# EAGLE design schematic_2 (EAGLE 8.7.0)
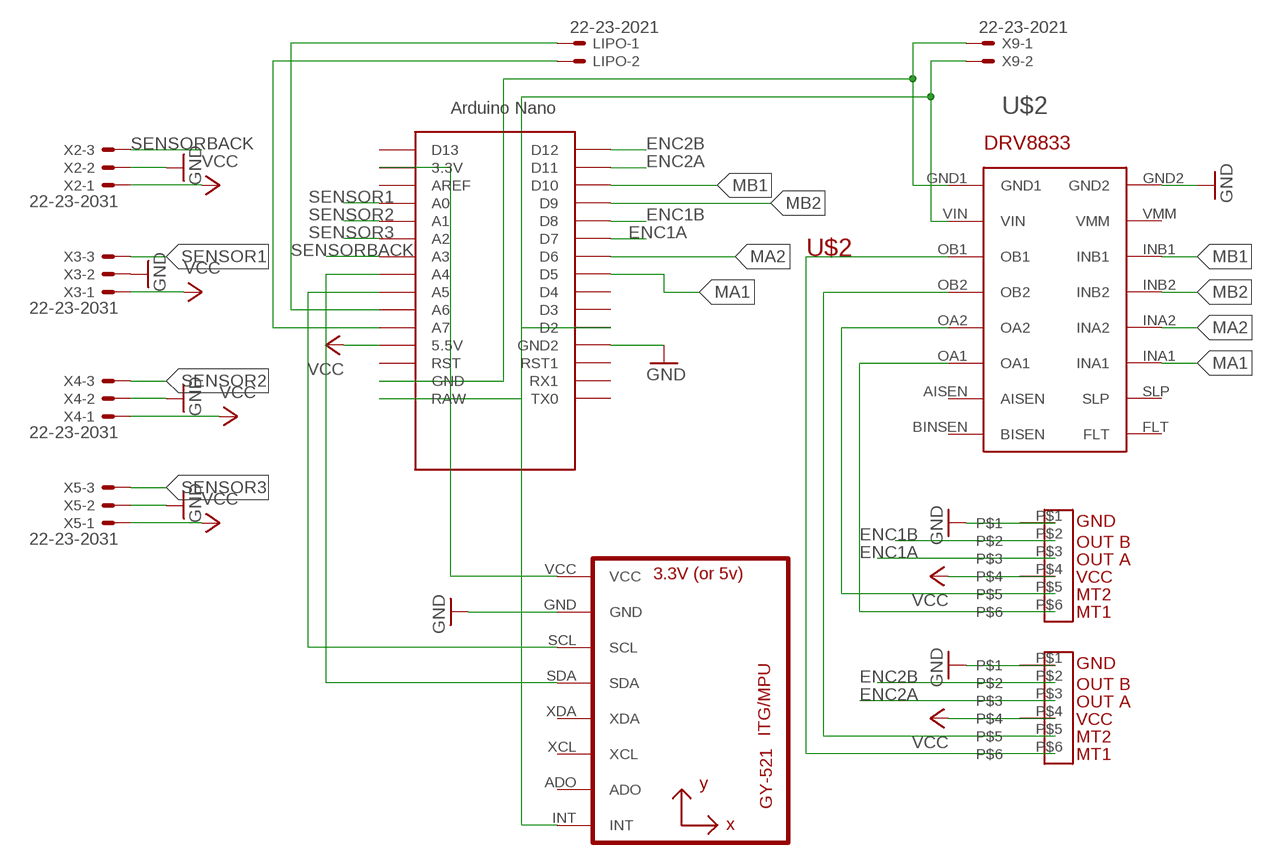
[diagram p0: schematic, sheet 1]

## Parts
LIPO  22-23-2021  [22-23-2021]
U1  GY-521MPU6050  [GY-521]
U$1  NANO  [NANO]
U$2  POLOLU-DRV8833  [POLOLU-DRV8833]
U$3  PINHEADER  [PINHEADER]
U$4  PINHEADER  [PINHEADER]
X2  22-23-2031  [22-23-2031]
X3  22-23-2031  [22-23-2031]
X4  22-23-2031  [22-23-2031]
X5  22-23-2031  [22-23-2031]
X9  22-23-2021  [22-23-2021]

## Nets
ENC1A: U$1.D7 U$3.P$3
ENC1B: U$1.D8 U$3.P$2
ENC2A: U$1.D11 U$4.P$3
ENC2B: U$1.D12 U$4.P$2
GND: U1.GND U$1.GND1(GND2) U$2.GND2 U$3.P$1 U$4.P$1 X2.2 X3.2 X4.2 X5.2
MA1: U$1.D5 U$2.INA1
MA2: U$1.D6 U$2.INA2
MB1: U$1.D10 U$2.INB1
MB2: U$1.D9 U$2.INB2
N$3: LIPO.1 U$1.A6
N$4: LIPO.2 U$1.A7
N$5: U1.VCC U$1.3.3V
N$6: U1.SCL U$1.A5
N$7: U1.SDA U$1.A4
N$8: U$2.OA2 U$3.P$5
N$9: U$1.GND U$2.GND1 X9.1
N$10: U$1.RAW U$2.VIN X9.2
N$11: U$2.OA1 U$3.P$6
N$12: U$2.OB2 U$4.P$5
N$13: U$2.OB1 U$4.P$6
N$14: U1.INT U$1.D2
SENSOR1: U$1.A0 X3.3
SENSOR2: U$1.A1 X4.3
SENSOR3: U$1.A2 X5.3
SENSORBACK: U$1.A3 X2.3
VCC: U$1.5V(5.5V) U$3.P$4 U$4.P$4 X2.1 X3.1 X4.1 X5.1
Unconnected: U1.ADO U1.XCL U1.XDA U$1.AREF U$1.D3 U$1.D4 U$1.D13 U$1.ICSP1 U$1.ICSP2 U$1.ICSP3 U$1.ICSP4 U$1.ICSP5 U$1.ICSP6 U$1.RST U$1.RST1 U$1.RX1 U$1.TX0 U$2.AISEN U$2.BINSEN(BISEN) U$2.FLT U$2.SLP U$2.VMM

## Library data of the parts
LIPO X9 = con-molex:22-23-2021: .100" (2.54mm) Center Header - 2 Pin; MF: MOLEX; MPN: 22-23-2021; OC_FARNELL: 1462926; OC_NEWARK: 25C3832
U1 = gy-521:GY-521
U$1 = Arduino-clone:NANO: Arduino Nano
U$2 = Pololu_Driver_DRV8833:POLOLU-DRV8833: Created by: Deltarios DRV8833 pololu dual drive controller, PCB-ready device
U$3 U$4 = pololu encoder board:PINHEADER
X2-X5 = con-molex:22-23-2031: .100" (2.54mm) Center Header - 3 Pin; MF: MOLEX; MPN: 22-23-2031; OC_FARNELL: 1462950; OC_NEWARK: 30C0862

## Net classes
0 default: width 0.254 mm, drill 0.254 mm, clearance 0.508 mm

## Board
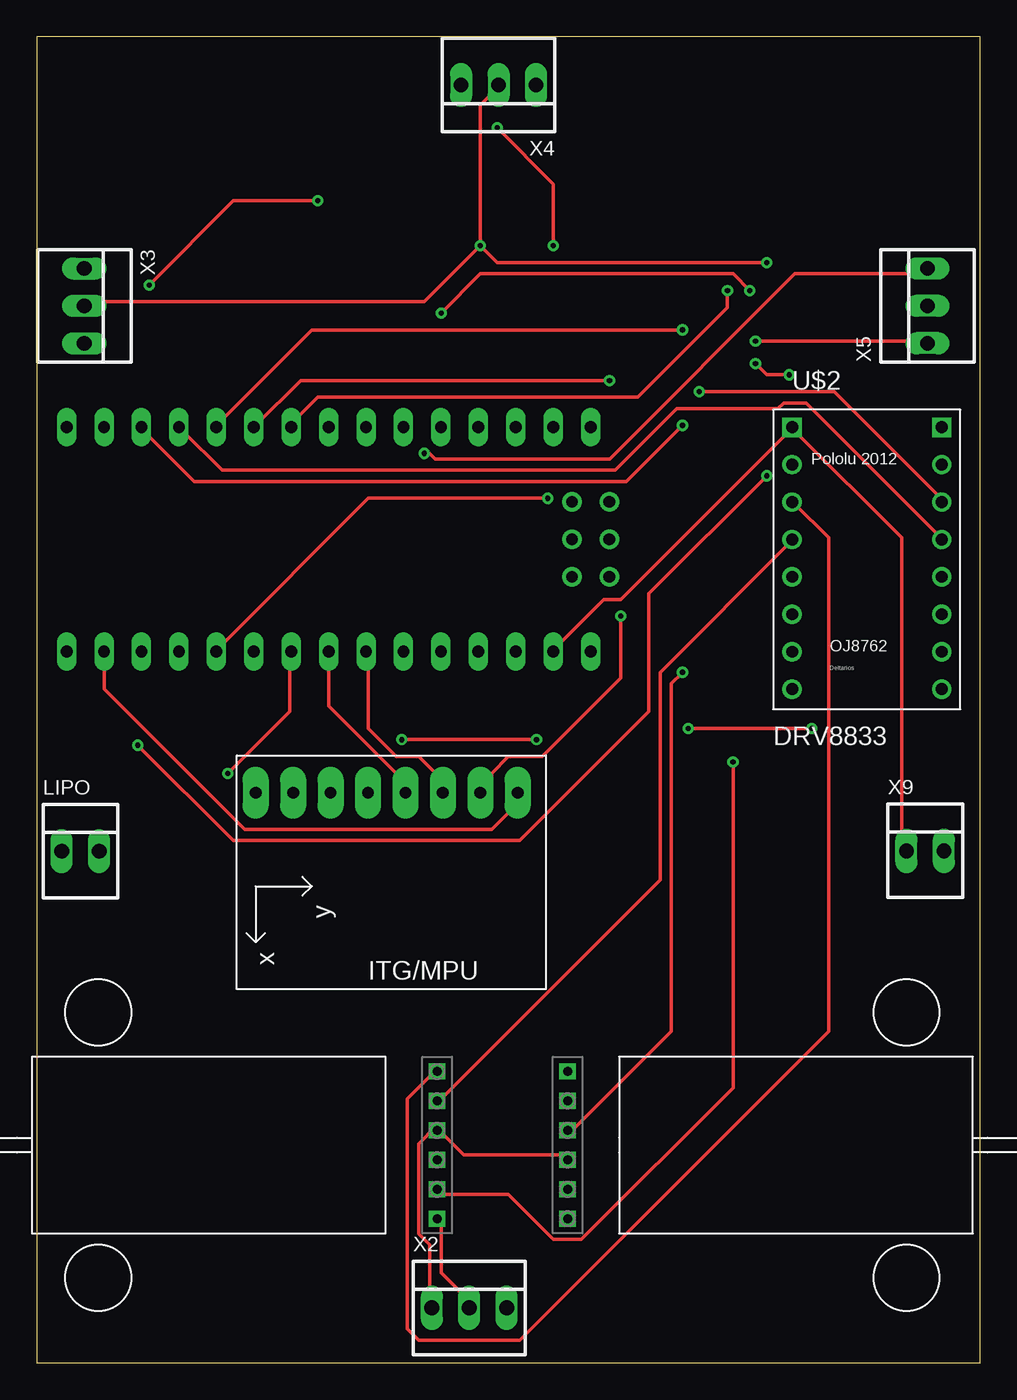
[diagram p1: board, top side]
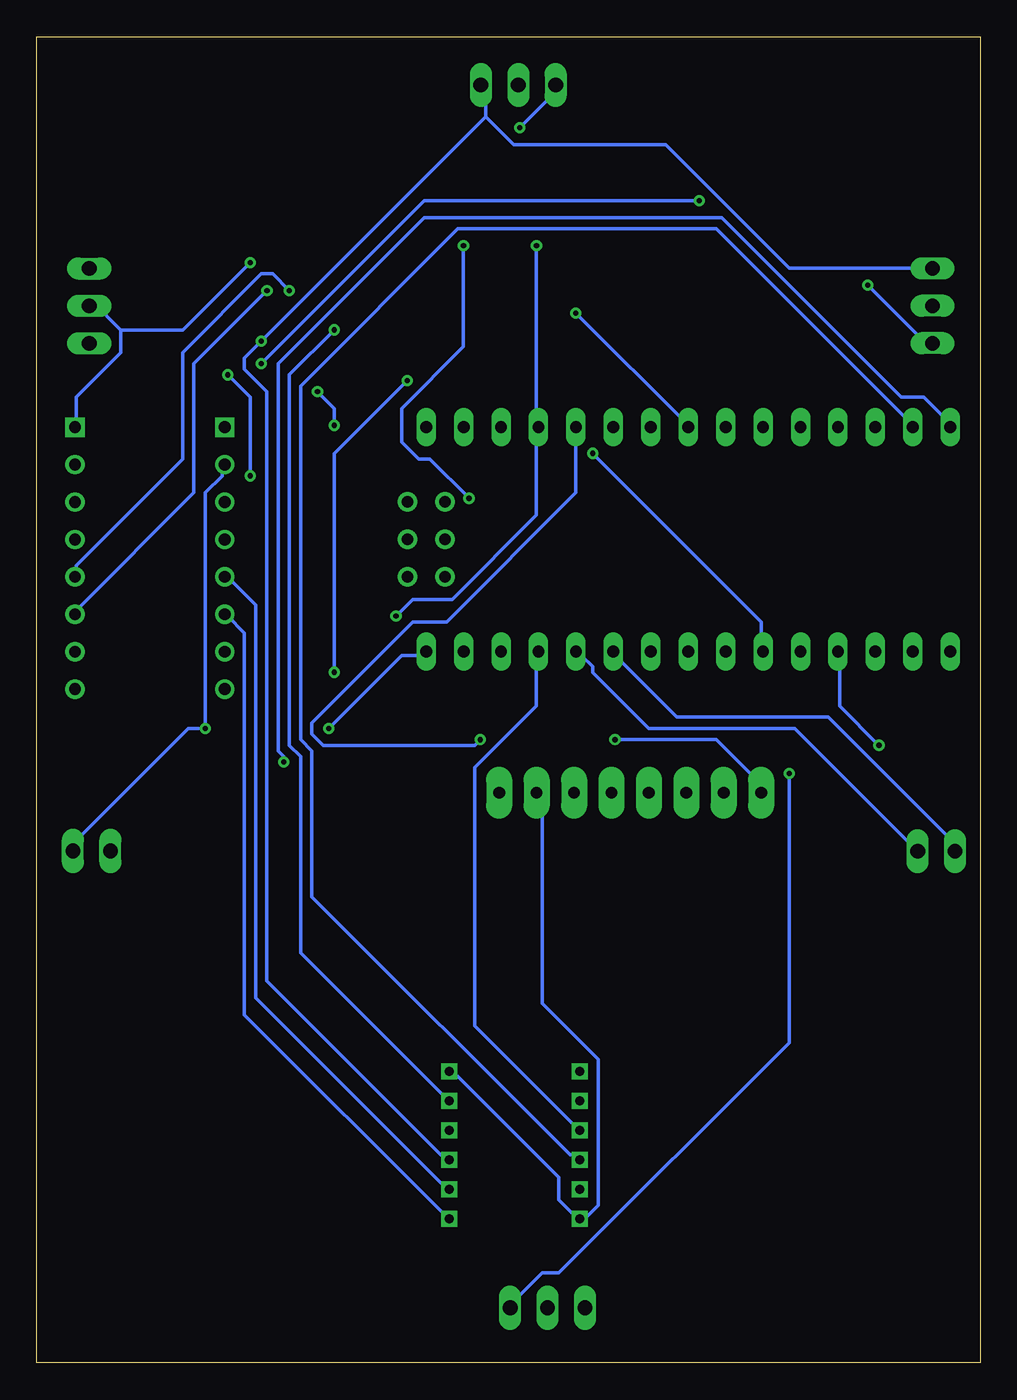
[diagram p2: board, bottom side, seen from below]

Size 64 x 90 mm. Coordinates in mm from the lower left corner, seen from the top.
Outline: 0,0 64,0 64,90 0,90 0,0
Copper layers (1*16): Top 0.035mm / dielectric 1.5mm / Bottom 0.035mm
Design rules "default": minimum track width 6mil, minimum drill 0.35mm, track to track 6mil, track to pad 6mil, pad to pad 6mil, via to via 6mil, smd to smd 6mil, copper to edge 40mil, drill to drill 6mil, minimum pad ring 10mil, minimum via ring 8mil, stop-mask expansion 4mil, vias tented up to drill 0mil, thermal gap 10mil

### Footprints (pad centres in the part's own frame; a part is rotated, then mirrored left to right if it is on the bottom)
22-23-2021 = drill 1 long: 1 -1.27,0; 2 1.27,0
GY-521 = drill 0.8 pad 1.778 long: ADO -8.89,-6.35; GND -8.89,6.35; INT -8.89,-8.89; SCL -8.89,3.81; SDA -8.89,1.27; VCC -8.89,8.89; XCL -8.89,-3.81; XDA -8.89,-1.27
NANO = drill 0.8 long: 3.3V -10.16,24.13; 5V -10.16,-1.27; A0 -10.16,19.05; A1 -10.16,16.51; A2 -10.16,13.97; A3 -10.16,11.43; A4 -10.16,8.89; A5 -10.16,6.35; A6 -10.16,3.81; A7 -10.16,1.27; AREF -10.16,21.59; D2 5.08,1.27; D3 5.08,3.81; D4 5.08,6.35; D5 5.08,8.89; D6 5.08,11.43; D7 5.08,13.97; D8 5.08,16.51; D9 5.08,19.05; D10 5.08,21.59; D11 5.08,24.13; D12 5.08,26.67; D13 -10.16,26.67; GND -10.16,-6.35; GND1 5.08,-1.27; RAW -10.16,-8.89; RST -10.16,-3.81; RST1 5.08,-3.81; RX1 5.08,-6.35; TX0 5.08,-8.89 | drill 0.8: ICSP1 -5.08,-10.16; ICSP2 -5.08,-7.62; ICSP3 -2.54,-10.16; ICSP4 -2.54,-7.62; ICSP5 0,-10.16; ICSP6 0,-7.62
POLOLU-DRV8833 = drill 0.8: AISEN -3.81,-7.62; BINSEN -3.81,-10.16; FLT 6.35,-10.16; INA1 6.35,-5.08; INA2 6.35,-2.54; INB1 6.35,2.54; INB2 6.35,0; OA1 -3.81,-5.08; OA2 -3.81,-2.54; OB1 -3.81,2.54; OB2 -3.81,0; SLP 6.35,-7.62; VIN -3.81,5.08; VMM 6.35,5.08 | drill 0.8 square: GND1 -3.81,7.62; GND2 6.35,7.62
PINHEADER = drill 0.6 square: P$1 0.5,0.5; P$2 2.5,0.5; P$3 4.5,0.5; P$4 6.5,0.5; P$5 8.5,0.5; P$6 10.5,0.5
22-23-2031 = drill 1 long: 1 -2.54,0; 2 0,0; 3 2.54,0

### Placement (x,y rotation side)
LIPO  2.96,34.72 0 top
U1  23.74,29.8 270 top
U$1  28.69,58.43 90 top
U$2  55.06,55.88 0 top
U$3  35.52,20.27 270 top
U$4  27.66,9.27 90 top
X2  29.34,3.72 0 top
X3  3.22,71.74 270 top
X4  31.33,86.74 180 top
X5  60.44,71.74 90 top
X9  60.28,34.74 0 top

### Tracks (layer width: path | path; a pad name or v marks a point on that pad's centre or on a via)
ENC1A  (via drill 0.35)
  Top 0.254: v43.81,46.86 43.05,46.1 43.05,22.48 36.58,16 36.2,16 U$3.P$3 | v38.86,66.67 17.91,66.67 14.86,63.63 U$1.D7
  Bottom 0.254: v43.81,46.86 43.81,61.72 v38.86,66.67
ENC1B  (via drill 0.35)
  Top 0.254: v43.81,70.1 18.67,70.1 12.19,63.63 U$1.D8
  Bottom 0.254: v43.81,70.1 46.86,67.06 46.86,41.91 46.1,41.15 46.1,27.81 36.2,17.91 U$3.P$2
ENC2A
  Bottom 0.254: U$4.P$3 27.43,14.1 27.81,14.1 45.34,31.62 45.34,41.53 46.1,42.29 46.1,66.29 35.43,76.96 17.91,76.96 4.57,63.63 U$1.D11
ENC2B  (via drill 0.35)
  Top 0.254: v47.24,40.77 47.24,18.67 36.96,8.38 35.05,8.38 32,11.43 27.43,11.43 U$4.P$2
  Bottom 0.254: v47.24,40.77 47.24,41.15 47.62,41.53 47.62,67.82 37.72,77.72 17.53,77.72 5.33,65.53 3.81,65.53 1.91,63.63 U$1.D12
GND  (via drill 0.35)
  Top 0.254: U$4.P$1 27.43,9.53 27.43,6.1 29.72,3.81 X2.2 | v30.1,75.82 30.1,85.34 31.24,86.49 X4.2 | v30.1,75.82 26.29,72.01 3.43,72.01 X3.2 | v49.53,74.68 31.24,74.68 v30.1,75.82 | v39.62,50.67 39.62,46.48 34.29,41.15 32,41.15 30.86,40.01 30.86,39.62 30.1,38.86 U1.GND
  Bottom 0.254: U$3.P$1 35.81,19.43 35.43,19.43 28.57,12.57 28.57,11.05 27.43,9.91 U$4.P$1 27.05,9.53 25.91,10.67 25.91,20.57 29.72,24.38 29.72,38.48 U1.GND | 58.29,70.1 58.29,68.58 61.34,65.53 61.34,63.63 U$2.GND2 | 58.29,70.1 60.2,72.01 X5.2 | v30.1,75.82 30.1,63.63 U$1.GND1 30.1,63.25 30.1,57.53 35.81,51.82 38.48,51.82 v39.62,50.67 | 58.29,70.1 54.1,70.1 v49.53,74.68
MA1  (via drill 0.35)
  Top 0.254: v48.39,72.77 47.24,73.91 30.1,73.91 v27.43,71.25
  Bottom 0.254: v48.39,72.77 53.34,67.82 53.34,59.05 61.34,51.05 U$2.INA1 | v27.43,71.25 19.81,63.63 U$1.D5
MA2  (via drill 0.35)
  Top 0.254: v46.86,72.77 46.86,71.63 40.77,65.53 19.05,65.53 17.14,63.63 U$1.D6
  Bottom 0.254: v46.86,72.77 48.01,73.91 48.77,73.91 54.1,68.58 54.1,61.34 61.34,54.1 61.34,53.34 U$2.INA2
MB1  (via drill 0.35)
  Top 0.254: v43.81,63.63 40.01,59.82 10.67,59.82 7.24,63.25 U$1.D10 | v44.96,65.91 54.1,65.91 61.34,58.67 U$2.INB1
  Bottom 0.254: v43.81,63.63 43.81,64.77 v44.96,65.91
MB2
  Top 0.254: U$1.D9 9.91,63.25 12.57,60.58 39.24,60.58 43.43,64.77 50.29,64.77 50.67,65.15 52.2,65.15 61.34,56.01 U$2.INB2
N$3
  Bottom 0.254: U$1.A6 24.77,48.01 20.57,43.81 10.29,43.81 1.52,35.05 LIPO.1
N$4
  Bottom 0.254: U$1.A7 27.05,48.01 26.29,47.24 26.29,46.86 22.48,43.05 12.57,43.05 4.57,35.05 LIPO.2
N$5
  Top 0.254: U$1.3.3V 4.57,48.01 4.57,45.72 14.1,36.2 30.86,36.2 32.38,37.72 32.38,38.48 U1.VCC
N$6
  Top 0.254: U$1.A5 22.48,48.01 22.48,43.05 24.38,41.15 25.91,41.15 27.43,39.62 27.43,38.86 U1.SCL
N$7
  Top 0.254: U$1.A4 19.81,48.01 19.81,44.58 24.77,39.62 24.77,38.86 U1.SDA
N$8
  Bottom 0.254: U$3.P$5 36.2,11.81 49.15,24.77 49.15,51.44 51.05,53.34 U$2.OA2
N$9
  Top 0.254: U$1.GND 35.05,48.39 38.48,51.82 39.62,51.82 51.05,63.25 U$2.GND1 51.44,63.25 58.67,56.01 58.67,35.05 X9.1
N$10  (via drill 0.35)
  Top 0.254: v52.58,43.05 v44.2,43.05
  Bottom 0.254: v44.2,43.05 39.24,48.01 37.72,48.01 U$1.RAW | X9.2 61.72,35.05 53.72,43.05 v52.58,43.05 52.58,59.05 51.44,60.2 51.44,60.96 U$2.VIN
N$11
  Bottom 0.254: U$3.P$6 36.2,9.91 49.91,23.62 49.91,49.53 51.05,50.67 U$2.OA1
N$12
  Top 0.254: U$4.P$5 27.43,17.91 42.29,32.77 42.29,46.86 51.05,55.63 U$2.OB2
N$13
  Top 0.254: U$4.P$6 27.05,19.43 26.67,19.43 25.15,17.91 25.15,2.29 25.91,1.52 32.77,1.52 53.72,22.48 53.72,56.01 51.44,58.29 U$2.OB1
N$14  (via drill 0.35)
  Top 0.254: v24.77,42.29 v33.91,42.29
  Bottom 0.254: v33.91,42.29 34.29,41.91 44.58,41.91 45.34,42.67 45.34,43.43 38.48,50.29 36.2,50.29 27.43,59.05 27.43,63.25 U$1.D2 | v24.77,42.29 17.91,42.29 14.48,38.86 U1.INT
SENSOR1  (via drill 0.35)
  Top 0.254: v6.86,41.91 13.34,35.43 32.77,35.43 41.53,44.2 41.53,52.2 v49.53,60.2 | v51.05,67.06 49.53,67.06 v48.77,67.82 | v19.05,78.87 13.34,78.87 v7.62,73.15
  Bottom 0.254: v6.86,41.91 9.53,44.58 9.53,48.01 U$1.A0 | v49.53,60.2 49.53,65.53 v51.05,67.06 | v48.77,67.82 37.72,78.87 v19.05,78.87 | v7.62,73.15 3.43,68.96 X3.3
SENSOR2  (via drill 0.35)
  Top 0.254: v34.67,58.67 22.48,58.67 12.19,48.39 U$1.A1 | v35.05,75.82 35.05,80.01 v31.24,83.82
  Bottom 0.254: v34.67,58.67 37.34,61.34 38.1,61.34 39.24,62.48 39.24,64.77 35.05,68.96 v35.05,75.82 | v31.24,83.82 28.57,86.49 X4.3
SENSOR3  (via drill 0.35)
  Top 0.254: v26.29,61.72 26.67,61.72 27.05,61.34 38.86,61.34 51.44,73.91 60.2,73.91 X5.3
  Bottom 0.254: v26.29,61.72 14.86,50.29 14.86,48.39 U$1.A2
SENSORBACK  (via drill 0.35)
  Top 0.254: v12.95,40.01 17.14,44.2 17.14,48.01 U$1.A3
  Bottom 0.254: v12.95,40.01 12.95,21.72 28.57,6.1 29.72,6.1 32,3.81 X2.3
VCC  (via drill 0.35)
  Top 0.254: U$3.P$4 35.81,14.1 28.96,14.1 27.43,15.62 U$4.P$4 27.05,16 25.91,14.86 25.91,8.76 26.67,8 26.67,3.81 X2.1 | v48.77,69.34 60.2,69.34 X5.1
  Bottom 0.254: U$1.5V 30.1,48.01 30.1,44.58 34.29,40.39 34.29,22.86 27.43,16 U$4.P$4 | 33.53,84.58 31.62,82.68 21.34,82.68 12.95,74.3 3.43,74.3 X3.1 | 33.53,84.58 33.53,86.49 X4.1 | 33.53,84.58 v48.77,69.34 49.91,68.2 49.91,67.44 48.39,65.91 48.39,25.91 36.58,14.1 36.2,14.1 U$3.P$4